# EAGLE design ZIF_Socket (EAGLE 5.10)
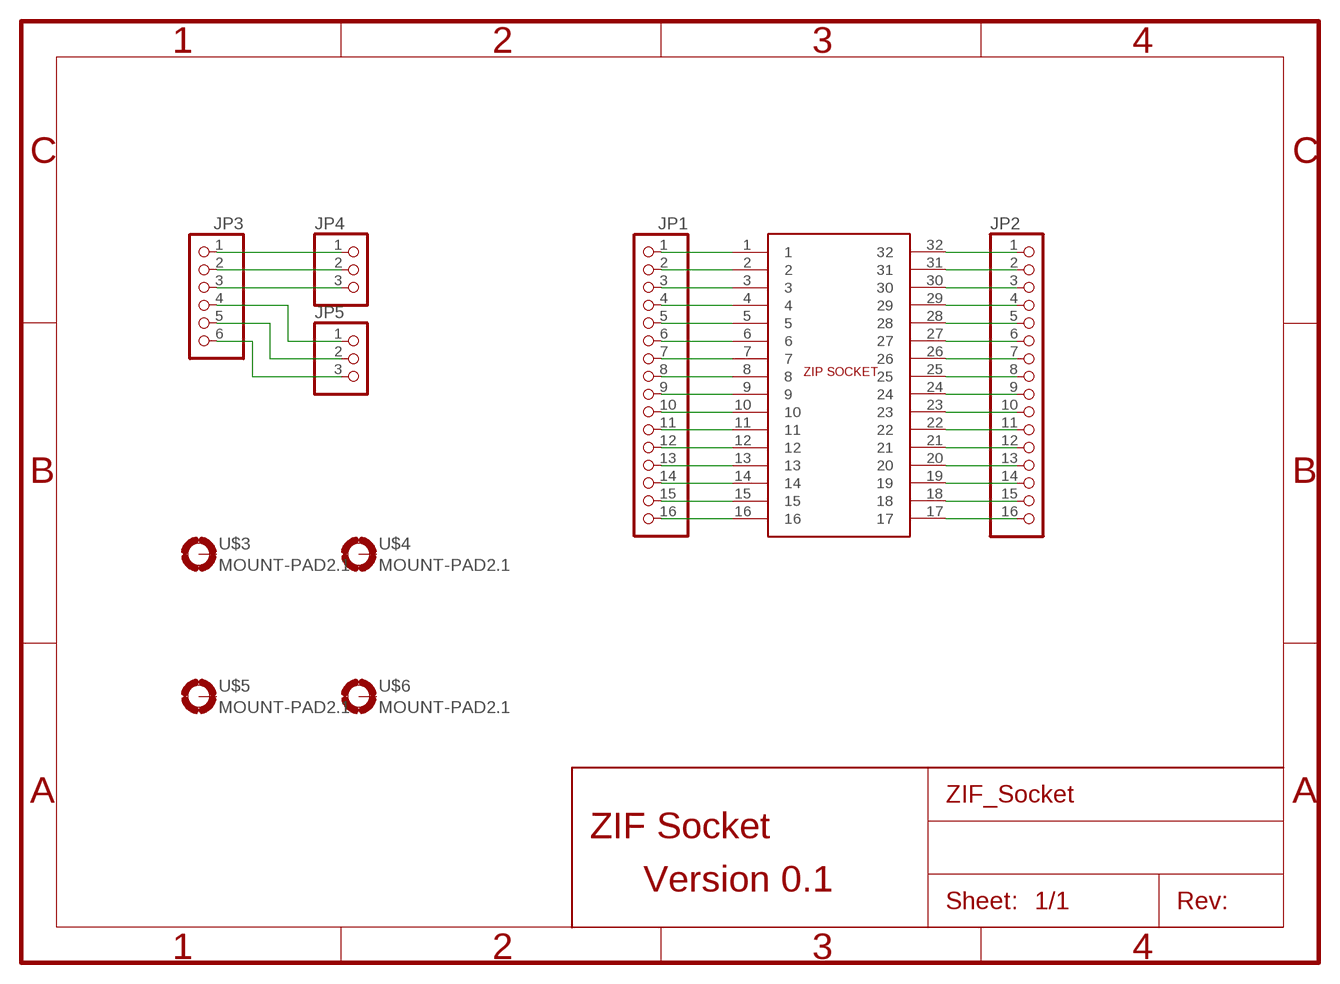
[diagram p0: schematic, sheet 1]

## Parts
JP1  PINHD-1X16_2.54  [1X16]
JP2  PINHD-1X16_2.54  [1X16]
JP3  PINHD-1X06_2.54-90°  [1X06/90]
JP4  PINHD-1X03_2.54  [1X03]
JP5  PINHD-1X03_2.54  [1X03]
U1  ZIP-SOCKET  [DIL32]
U$3  MOUNT-PAD2.1  [PAD-2.1]
U$4  MOUNT-PAD2.1  [PAD-2.1]
U$5  MOUNT-PAD2.1  [PAD-2.1]
U$6  MOUNT-PAD2.1  [PAD-2.1]

## Nets
N$1: JP1.1 U1.1
N$2: JP1.2 U1.2
N$3: JP1.3 U1.3
N$4: JP1.4 U1.4
N$5: JP1.5 U1.5
N$6: JP1.6 U1.6
N$7: JP1.7 U1.7
N$8: JP1.8 U1.8
N$9: JP1.9 U1.9
N$10: JP1.10 U1.10
N$11: JP1.11 U1.11
N$12: JP1.12 U1.12
N$13: JP1.13 U1.13
N$14: JP1.14 U1.14
N$15: JP1.15 U1.15
N$16: JP1.16 U1.16
N$17: JP2.1 U1.32
N$18: JP2.2 U1.31
N$19: JP2.3 U1.30
N$20: JP2.4 U1.29
N$21: JP2.5 U1.28
N$22: JP2.6 U1.27
N$23: JP2.7 U1.26
N$24: JP2.8 U1.25
N$25: JP2.9 U1.24
N$26: JP2.10 U1.23
N$27: JP2.11 U1.22
N$28: JP2.12 U1.21
N$29: JP2.14 U1.19
N$30: JP2.15 U1.18
N$31: JP2.16 U1.17
N$32: JP2.13 U1.20
N$33: JP3.1 JP4.1
N$34: JP3.2 JP4.2
N$35: JP3.3 JP4.3
N$36: JP3.4 JP5.1
N$37: JP3.5 JP5.2
N$38: JP3.6 JP5.3
Unconnected: U$3.B2,1(MOUNT) U$4.B2,1(MOUNT) U$5.B2,1(MOUNT) U$6.B2,1(MOUNT)

## Notes on the sheet
- ZIF Socket
- Version 0.1

## Library data of the parts
JP1 JP2 = pinheader:PINHD-1X16: PIN HEADER
JP3 = pinheader:PINHD-1X06: PIN HEADER
JP4 JP5 = pinheader:PINHD-1X03: PIN HEADER
U1 = bant:ZIP-SOCKET
U$3-U$6 = MyLib:MOUNT-PAD: 2.1mm Mount Pad (Connectable to GND)

## Board
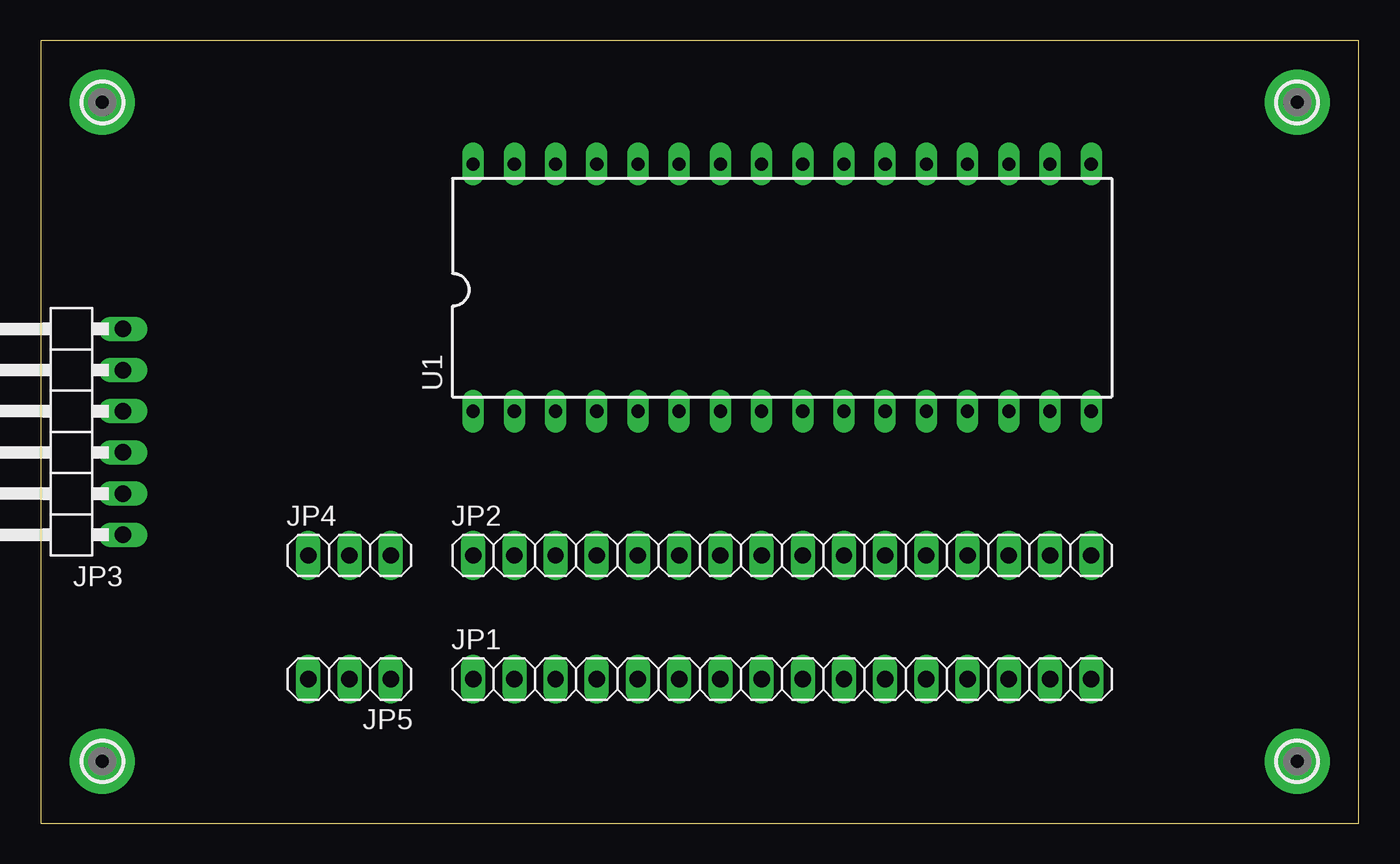
[diagram p1: board, top side]
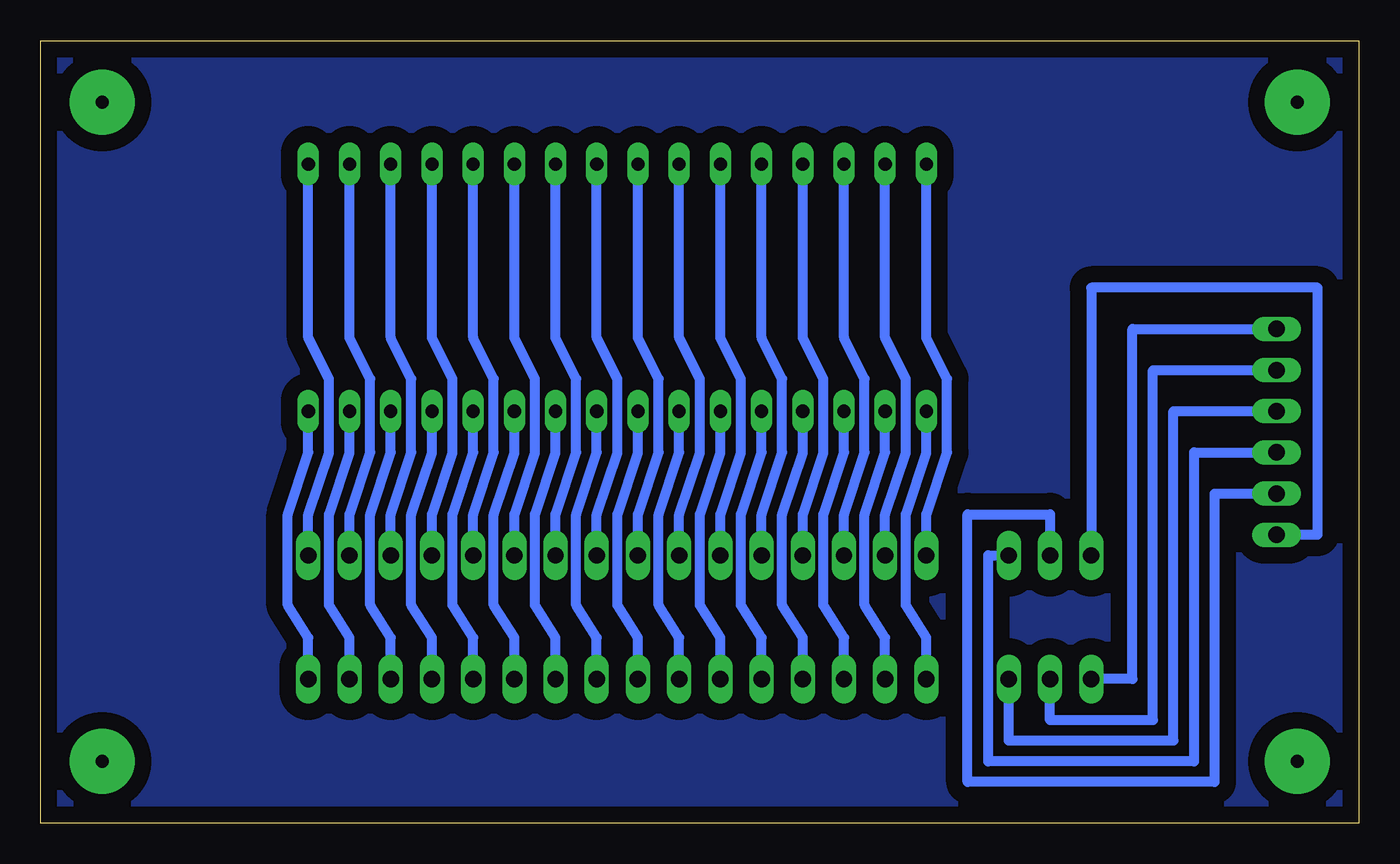
[diagram p2: board, bottom side, seen from below]

Size 81.28 x 48.26 mm. Coordinates in mm from the lower left corner, seen from the top.
Outline: 0,0 81.28,0 81.28,48.26 0,48.26 0,0
Copper layers (1*16): Top 0.035mm / dielectric 1.5mm / Bottom 0.035mm
Design rules "default": minimum track width 10mil, minimum drill 24mil, track to track 8mil, track to pad 8mil, pad to pad 8mil, via to via 8mil, smd to smd 8mil, copper to edge 40mil, drill to drill 8mil, minimum pad ring 10mil, minimum via ring 8mil, stop-mask expansion 4mil, vias tented up to drill 0mil, thermal gap 10mil

### Footprints (pad centres in the part's own frame; a part is rotated, then mirrored left to right if it is on the bottom)
1X16 = drill 1.016 long: 1 -19.05,0; 2 -16.51,0; 3 -13.97,0; 4 -11.43,0; 5 -8.89,0; 6 -6.35,0; 7 -3.81,0; 8 -1.27,0; 9 1.27,0; 10 3.81,0; 11 6.35,0; 12 8.89,0; 13 11.43,0; 14 13.97,0; 15 16.51,0; 16 19.05,0
1X06/90 = drill 1.016 long: 1 -6.35,-3.81; 2 -3.81,-3.81; 3 -1.27,-3.81; 4 1.27,-3.81; 5 3.81,-3.81; 6 6.35,-3.81
1X03 = drill 1.016 long: 1 -2.54,0; 2 0,0; 3 2.54,0
DIL32 = drill 0.813 long: 1 -19.05,-7.62; 2 -16.51,-7.62; 3 -13.97,-7.62; 4 -11.43,-7.62; 5 -8.89,-7.62; 6 -6.35,-7.62; 7 -3.81,-7.62; 8 -1.27,-7.62; 9 1.27,-7.62; 10 3.81,-7.62; 11 6.35,-7.62; 12 8.89,-7.62; 13 11.43,-7.62; 14 13.97,-7.62; 15 16.51,-7.62; 16 19.05,-7.62; 17 19.05,7.62; 18 16.51,7.62; 19 13.97,7.62; 20 11.43,7.62; 21 8.89,7.62; 22 6.35,7.62; 23 3.81,7.62; 24 1.27,7.62; 25 -1.27,7.62; 26 -3.81,7.62; 27 -6.35,7.62; 28 -8.89,7.62; 29 -11.43,7.62; 30 -13.97,7.62; 31 -16.51,7.62; 32 -19.05,7.62
PAD-2.1 = drill 0.8 pad 4 round: B2,1 0,0

### Placement (x,y rotation side)
JP1  45.72,8.89 0 top
JP2  45.72,16.51 0 top
JP3  1.27,24.13 90 top
JP4  19.05,16.51 0 top
JP5  19.05,8.89 180 top
U1  45.72,33.02 0 top
U$3  3.81,44.45 0 top
U$4  3.81,3.81 0 top
U$5  77.47,3.81 0 top
U$6  77.47,44.45 0 top

### Tracks (layer width: path | path; a pad name or v marks a point on that pad's centre or on a via)
N$1
  Bottom 0.61: U1.1 26.67,22.86 27.94,19.05 27.94,13.43 26.67,11.43 JP1.1
N$2
  Bottom 0.61: U1.2 29.21,22.86 30.48,19.05 30.48,13.43 29.21,11.43 JP1.2
N$3
  Bottom 0.61: U1.3 31.75,22.86 33.02,19.05 33.02,13.43 31.75,11.43 JP1.3
N$4
  Bottom 0.61: U1.4 34.29,22.86 35.56,19.05 35.56,13.43 34.29,11.43 JP1.4
N$5
  Bottom 0.61: U1.5 36.83,22.86 38.1,19.05 38.1,13.43 36.83,11.43 JP1.5
N$6
  Bottom 0.61: U1.6 39.37,22.86 40.64,19.05 40.64,13.43 39.37,11.43 JP1.6
N$7
  Bottom 0.61: U1.7 41.91,22.86 43.18,19.05 43.18,13.43 41.91,11.43 JP1.7
N$8
  Bottom 0.61: U1.8 44.45,22.86 45.72,19.05 45.72,13.43 44.45,11.43 JP1.8
N$9
  Bottom 0.61: U1.9 46.99,22.86 48.26,19.05 48.26,13.43 46.99,11.43 JP1.9
N$10
  Bottom 0.61: U1.10 49.53,22.86 50.8,19.05 50.8,13.43 49.53,11.43 JP1.10
N$11
  Bottom 0.61: U1.11 52.07,22.86 53.34,19.05 53.34,13.43 52.07,11.43 JP1.11
N$12
  Bottom 0.61: U1.12 54.61,22.86 55.88,19.05 55.88,13.43 54.61,11.43 JP1.12
N$13
  Bottom 0.61: U1.13 57.15,22.86 58.42,19.05 58.42,13.43 57.15,11.43 JP1.13
N$14
  Bottom 0.61: U1.14 59.69,22.86 60.96,19.05 60.96,13.43 59.69,11.43 JP1.14
N$15
  Bottom 0.61: U1.15 62.23,22.86 63.5,19.05 63.5,13.43 62.23,11.43 JP1.15
N$16
  Bottom 0.61: U1.16 64.77,22.86 66.04,19.05 66.04,13.43 64.77,11.43 JP1.16
N$17
  Bottom 0.61: U1.32 26.67,29.94 25.4,27.4 25.4,22.86 26.67,19.05 JP2.1
N$18
  Bottom 0.61: U1.31 29.21,29.94 27.94,27.4 27.94,22.86 29.21,19.05 JP2.2
N$19
  Bottom 0.61: U1.30 31.75,29.94 30.48,27.4 30.48,22.86 31.75,19.05 JP2.3
N$20
  Bottom 0.61: U1.29 34.29,29.94 33.02,27.4 33.02,22.86 34.29,19.05 JP2.4
N$21
  Bottom 0.61: U1.28 36.83,29.94 35.56,27.4 35.56,22.86 36.83,19.05 JP2.5
N$22
  Bottom 0.61: U1.27 39.37,29.94 38.1,27.4 38.1,22.86 39.37,19.05 JP2.6
N$23
  Bottom 0.61: U1.26 41.91,29.94 40.64,27.4 40.64,22.86 41.91,19.05 JP2.7
N$24
  Bottom 0.61: U1.25 44.45,29.94 43.18,27.4 43.18,22.86 44.45,19.05 JP2.8
N$25
  Bottom 0.61: U1.24 46.99,29.94 45.72,27.4 45.72,22.86 46.99,19.05 JP2.9
N$26
  Bottom 0.61: U1.23 49.53,29.94 48.26,27.4 48.26,22.86 49.53,19.05 JP2.10
N$27
  Bottom 0.61: U1.22 52.07,29.94 50.8,27.4 50.8,22.86 52.07,19.05 JP2.11
N$28
  Bottom 0.61: U1.21 54.61,29.94 53.34,27.4 53.34,22.86 54.61,19.05 JP2.12
N$29
  Bottom 0.61: U1.19 59.69,29.94 58.42,27.4 58.42,22.86 59.69,19.05 JP2.14
N$30
  Bottom 0.61: U1.18 62.23,29.94 60.96,27.4 60.96,22.86 62.23,19.05 JP2.15
N$31
  Bottom 0.61: U1.17 64.77,29.94 63.5,27.4 63.5,22.86 64.77,19.05 JP2.16
N$32
  Bottom 0.61: U1.20 57.15,29.94 55.88,27.4 55.88,22.86 57.15,19.05 JP2.13
N$33
  Bottom 0.61: JP4.1 16.51,33.02 2.54,33.02 2.54,17.78 JP3.1
N$34
  Bottom 0.61: JP3.2 8.89,20.32 8.89,2.54 24.13,2.54 24.13,19.05 19.05,19.05 JP4.2
N$35
  Bottom 0.61: JP3.3 10.16,22.86 10.16,3.81 22.86,3.81 22.86,16.51 JP4.3
N$36
  Bottom 0.61: JP3.4 11.43,25.4 11.43,5.08 21.59,5.08 JP5.1
N$37
  Bottom 0.61: JP3.5 12.7,27.94 12.7,6.35 19.05,6.35 JP5.2
N$38
  Bottom 0.61: JP3.6 13.97,30.48 13.97,8.89 JP5.3
N$39
  pour Bottom (isolate 1.016): 0,48.26 0,0 81.28,0 81.28,48.26